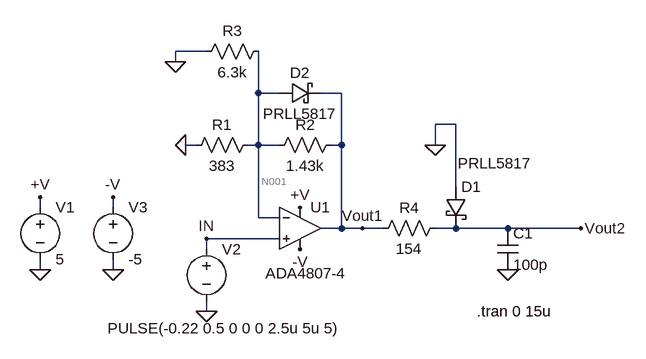
[diagram p0: schematic ADA4807-4.asc]
ADA4807-4.asc, the LTspice schematic file:
Version 4
SHEET 1 1240 700
WIRE 432 -1376 384 -1376
WIRE 384 -1360 384 -1376
WIRE 512 -1312 512 -1376
WIRE 544 -1312 512 -1312
WIRE 640 -1312 608 -1312
WIRE 816 -1264 784 -1264
WIRE 416 -1232 400 -1232
WIRE 512 -1232 512 -1312
WIRE 512 -1232 496 -1232
WIRE 544 -1232 512 -1232
WIRE 640 -1232 640 -1312
WIRE 640 -1232 624 -1232
WIRE 784 -1232 784 -1264
WIRE 816 -1168 816 -1264
WIRE 176 -1136 176 -1152
WIRE 288 -1136 288 -1152
WIRE 512 -1120 512 -1232
WIRE 544 -1120 512 -1120
WIRE 640 -1104 640 -1232
WIRE 640 -1104 608 -1104
WIRE 672 -1104 640 -1104
WIRE 704 -1104 672 -1104
WIRE 816 -1104 784 -1104
WIRE 896 -1104 816 -1104
WIRE 1008 -1104 896 -1104
WIRE 544 -1088 432 -1088
WIRE 432 -1072 432 -1088
WIRE 176 -1040 176 -1056
WIRE 288 -1040 288 -1056
WIRE 432 -976 432 -992
FLAG 176 -1152 +V
FLAG 176 -1040 0
FLAG 432 -976 0
FLAG 432 -1088 IN
FLAG 576 -1136 +V
FLAG 288 -1152 -V
FLAG 288 -1040 0
FLAG 400 -1232 0
FLAG 576 -1072 -V
FLAG 384 -1360 0
FLAG 784 -1232 0
FLAG 672 -1104 Vout1
FLAG 1008 -1104 Vout2
FLAG 896 -1040 0
SYMBOL voltage 176 -1152 R0
SYMATTR InstName V1
SYMATTR Value 5
SYMBOL voltage 432 -1088 R0
WINDOW 123 24 146 Left 2
WINDOW 39 24 125 Left 2
WINDOW 3 -152 138 Left 2
SYMATTR Value PULSE(-0.22 0.5 0 0 0 2.5u 5u 5)
SYMATTR InstName V2
SYMBOL res 512 -1248 R90
WINDOW 0 0 56 VBottom 2
WINDOW 3 32 56 VTop 2
SYMATTR InstName R1
SYMATTR Value 383
SYMBOL res 640 -1248 R90
WINDOW 0 0 56 VBottom 2
WINDOW 3 32 56 VTop 2
SYMATTR InstName R2
SYMATTR Value 1.43k
SYMBOL voltage 288 -1152 R0
SYMATTR InstName V3
SYMATTR Value -5
SYMBOL opamps\\ADA4807-4 576 -1168 R0
WINDOW 3 -53 133 Left 2
SYMATTR InstName U1
SYMBOL res 528 -1392 R90
WINDOW 0 0 56 VBottom 2
WINDOW 3 32 56 VTop 2
SYMATTR InstName R3
SYMATTR Value 6.3k
SYMBOL schottky 544 -1296 R270
WINDOW 0 32 32 VTop 2
WINDOW 3 0 32 VBottom 2
SYMATTR InstName D2
SYMATTR Value PRLL5817
SYMATTR Description Diode
SYMATTR Type diode
SYMBOL res 800 -1120 R90
WINDOW 0 0 56 VBottom 2
WINDOW 3 32 56 VTop 2
SYMATTR InstName R4
SYMATTR Value 154
SYMBOL schottky 800 -1168 R0
WINDOW 3 19 -36 Left 2
SYMATTR Value PRLL5817
SYMATTR InstName D1
SYMATTR Description Diode
SYMATTR Type diode
SYMBOL cap 880 -1104 R0
SYMATTR InstName C1
SYMATTR Value 100p
TEXT 848 -976 Left 2 !.tran 0 15u

The netlist it stands for:
* ADA4807-4.asc
V1 +V 0 5
V2 IN 0 PULSE(-0.22 0.5 0 0 0 2.5u 5u 5)
R1 N001 0 383
R2 Vout1 N001 1.43k
V3 -V 0 -5
XU1 IN N001 +V -V Vout1 ADA4807-4  ; pins In+ In- V+ V- OUT
R3 N001 0 6.3k
D2 N001 Vout1 PRLL5817
R4 Vout2 Vout1 154
D1 0 Vout2 PRLL5817
C1 Vout2 0 100p
.model D D
.lib standard.dio
.tran 0 15u
.backanno
.end

* Results of the author's LTspice run, read from the files saved beside the schematic
* Operating Point, zero values left out:
*   V(+v) = 5 V
*   V(in) = -220 mV
*   V(n001) = -220 mV
*   V(vout1) = -364.8 mV
*   V(-v) = -5 V
*   V(vout2) = -168.9 mV
*   I(D1) = 1.272 mA
*   I(D2) = 509.2 µA
*   I(R4) = 1.272 mA
*   I(R3) = -34.92 µA
*   I(R2) = -101.2 µA
*   I(R1) = -574.4 µA
*   I(V3) = 2.92 mA
*   I(V2) = 1.106 µA
*   I(V1) = -1.04 mA
*   Ix(u1:1) = -1.106 µA
*   Ix(u1:2) = -1.106 µA
*   Ix(u1:3) = 1.04 mA
*   Ix(u1:4) = -2.92 mA
*   Ix(u1:5) = 1.882 mA
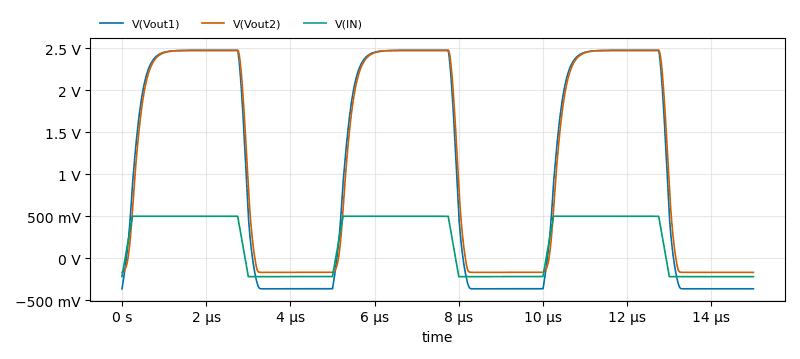
[diagram p1: Transient Analysis of ADA4807-4.asc, plotted from the saved traces]
* Transient Analysis, 1 run:
*   V(Vout1): min -364.8 mV, max 2.476 V, average 1.134 V, rms 1.736 V, last -364.8 mV
*   V(Vout2): min -168.9 mV, max 2.475 V, average 1.205 V, rms 1.722 V, last -168.9 mV
*   V(IN): min -220 mV, max 500 mV, average 176 mV, rms 388.2 mV, last -220 mV